# EAGLE schematic DC Electronic Load (EAGLE 9.4.0)
ERSTELLER: Jakob Holz; PROJEKT: DC Electronic Load; VERSION: V1.0

## Sheet 1 of 3
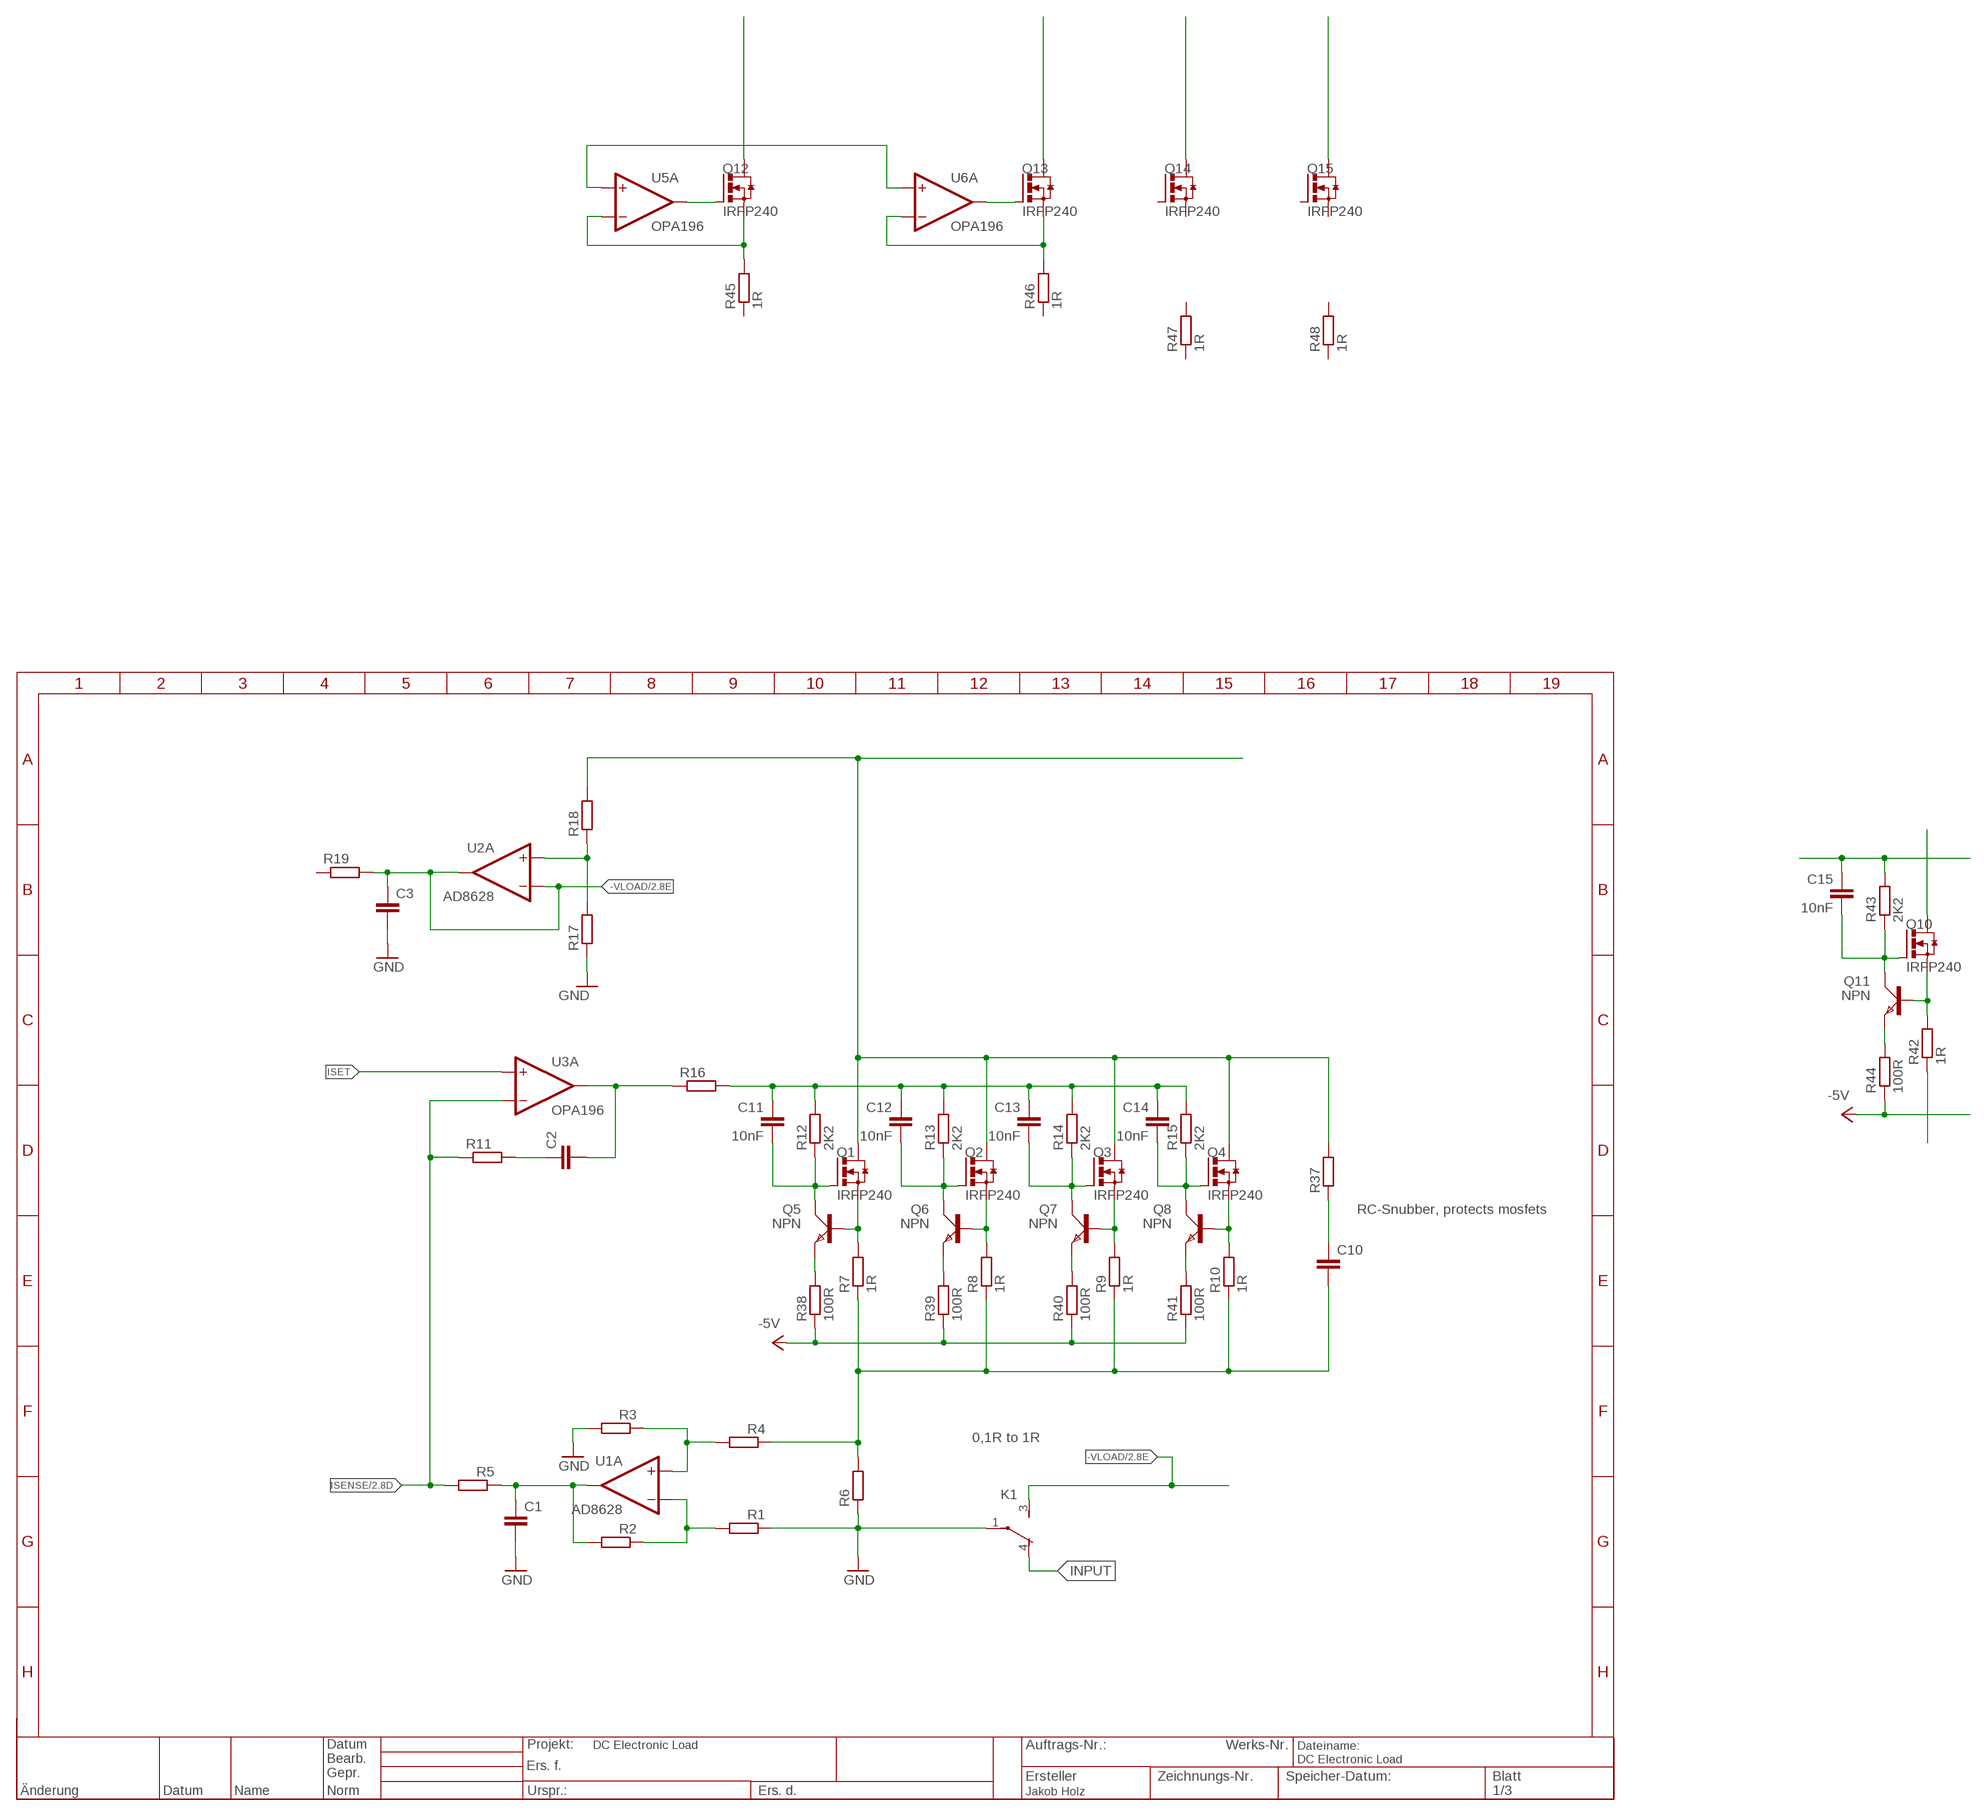
[diagram p0: schematic, sheet 1]
RAHMEN1 (RAHMEN_A4_8Z-19S): ERSTELLER: Jakob Holz; PROJEKT: DC Electronic Load

### Parts
C1  C-EUC1206  [C1206]
C2  C-EUC1206  [C1206]
C3  C-EUC1206  [C1206]
C10  C-EUC1206  [C1206]
C11  10nF  C-EUC1206  [C1206]
C12  10nF  C-EUC1206  [C1206]
C13  10nF  C-EUC1206  [C1206]
C14  10nF  C-EUC1206  [C1206]
C15  10nF  C-EUC1206  [C1206]
K1  AZ8-FORM-C  [AZ8]
Q1  IRFP240  [TO247BV]
Q2  IRFP240  [TO247BV]
Q3  IRFP240  [TO247BV]
Q4  IRFP240  [TO247BV]
Q5  NPN  [SOT23]
Q6  NPN  [SOT23]
Q7  NPN  [SOT23]
Q8  NPN  [SOT23]
Q10  IRFP240  [TO247BV]
Q11  NPN  [SOT23]
Q12  IRFP240  [TO247BV]
Q13  IRFP240  [TO247BV]
Q14  IRFP240  [TO247BV]
Q15  IRFP240  [TO247BV]
R1  R-EU_R1206  [R1206]
R2  R-EU_R1206  [R1206]
R3  R-EU_R1206  [R1206]
R4  R-EU_R1206  [R1206]
R5  R-EU_R1206  [R1206]
R6  R-EU_R1206  [R1206]
R7  1R  R-EU_VTA53  [VTA53]
R8  1R  R-EU_VTA53  [VTA53]
R9  1R  R-EU_VTA53  [VTA53]
R10  1R  R-EU_VTA53  [VTA53]
R11  R-EU_R1206  [R1206]
R12  2K2  R-EU_R1206  [R1206]
R13  2K2  R-EU_R1206  [R1206]
R14  2K2  R-EU_R1206  [R1206]
R15  2K2  R-EU_R1206  [R1206]
R16  R-EU_R1206  [R1206]
R17  R-EU_R1206  [R1206]
R18  R-EU_R1206  [R1206]
R19  R-EU_R1206  [R1206]
R37  R-EU_R1206  [R1206]
R38  100R  R-EU_R1206  [R1206]
R39  100R  R-EU_R1206  [R1206]
R40  100R  R-EU_R1206  [R1206]
R41  100R  R-EU_R1206  [R1206]
R42  1R  R-EU_VTA53  [VTA53]
R43  2K2  R-EU_R1206  [R1206]
R44  100R  R-EU_R1206  [R1206]
R45  1R  R-EU_VTA53  [VTA53]
R46  1R  R-EU_VTA53  [VTA53]
R47  1R  R-EU_VTA53  [VTA53]
R48  1R  R-EU_VTA53  [VTA53]
U1  AD8628  [SOIC-8]
U2  AD8628  [SOIC-8]
U3  OPA196  AD8628  [SOIC-8]
U5  OPA196  AD8628  [SOIC-8]
U6  OPA196  AD8628  [SOIC-8]

### Nets
+VLOAD: Q1.D Q2.D Q3.D Q4.D R18.2 R37.2 ; also sheet 2
+VLOAD1: Q10.D
-5V: R38.1 R39.1 R40.1 R41.1 R44.1
-VLOAD: C3.1 K1.3(-1:S) R19.2 U2.2(A:IN-) U2.6(A:OUT) ; also sheet 2
GND: C1.2 C3.2 K1.1(-1:P) R1.1 R3.2 R6.1 R17.1 ; also sheet 2,3
INPUT: K1.4(-1:O)
ISENSE: R5.2 R11.1 U3.2(A:IN-) ; also sheet 2
ISET: U3.3(A:IN+)
N$1: C1.1 R2.2 R5.1 U1.6(A:OUT)
N$2: R1.2 R2.1 U1.2(A:IN-)
N$3: R3.1 R4.2 U1.3(A:IN+)
N$4: C10.2 R4.1 R6.2 R7.1 R8.1 R9.1 R10.1
N$7: C2.1 R11.2
N$8: C2.2 R16.1 U3.6(A:OUT)
N$9: Q1.S Q5.1(B) R7.2
N$10: Q2.S Q6.1(B) R8.2
N$11: Q3.S Q7.1(B) R9.2
N$12: Q4.S Q8.1(B) R10.2
N$13: C11.1 C12.1 C13.1 C14.1 R12.2 R13.2 R14.2 R15.2 R16.2
N$14: C11.2 Q1.G Q5.3(C) R12.1
N$15: C12.2 Q2.G Q6.3(C) R13.1
N$16: C13.2 Q3.G Q7.3(C) R14.1
N$17: C14.2 Q4.G Q8.3(C) R15.1
N$19: Q6.2(E) R39.2
N$20: R17.2 R18.1 U2.3(A:IN+)
N$33: C10.1 R37.1
N$34: Q7.2(E) R40.2
N$35: Q8.2(E) R41.2
N$36: Q5.2(E) R38.2
N$37: R42.1
N$38: Q10.S Q11.1(B) R42.2
N$39: C15.1 R43.2
N$40: C15.2 Q10.G Q11.3(C) R43.1
N$41: Q11.2(E) R44.2
N$42: Q12.G U5.6(A:OUT)
N$43: Q12.D
N$44: Q12.S R45.2 U5.2(A:IN-)
N$45: Q13.D
N$46: Q14.D
N$47: Q15.D
N$48: Q13.S R46.2 U6.2(A:IN-)
N$49: Q13.G U6.6(A:OUT)
N$50: U5.3(A:IN+) U6.3(A:IN+)
Unconnected: Q14.G Q14.S Q15.G Q15.S R19.1 R45.1 R46.1 R47.1 R47.2 R48.1 R48.2 U5.4(B:V-) U5.7(B:V+) U6.4(B:V-) U6.7(B:V+)

### Notes on the sheet
- RC-Snubber, protects mosfets
- 0,1R to 1R

## Sheet 2 of 3
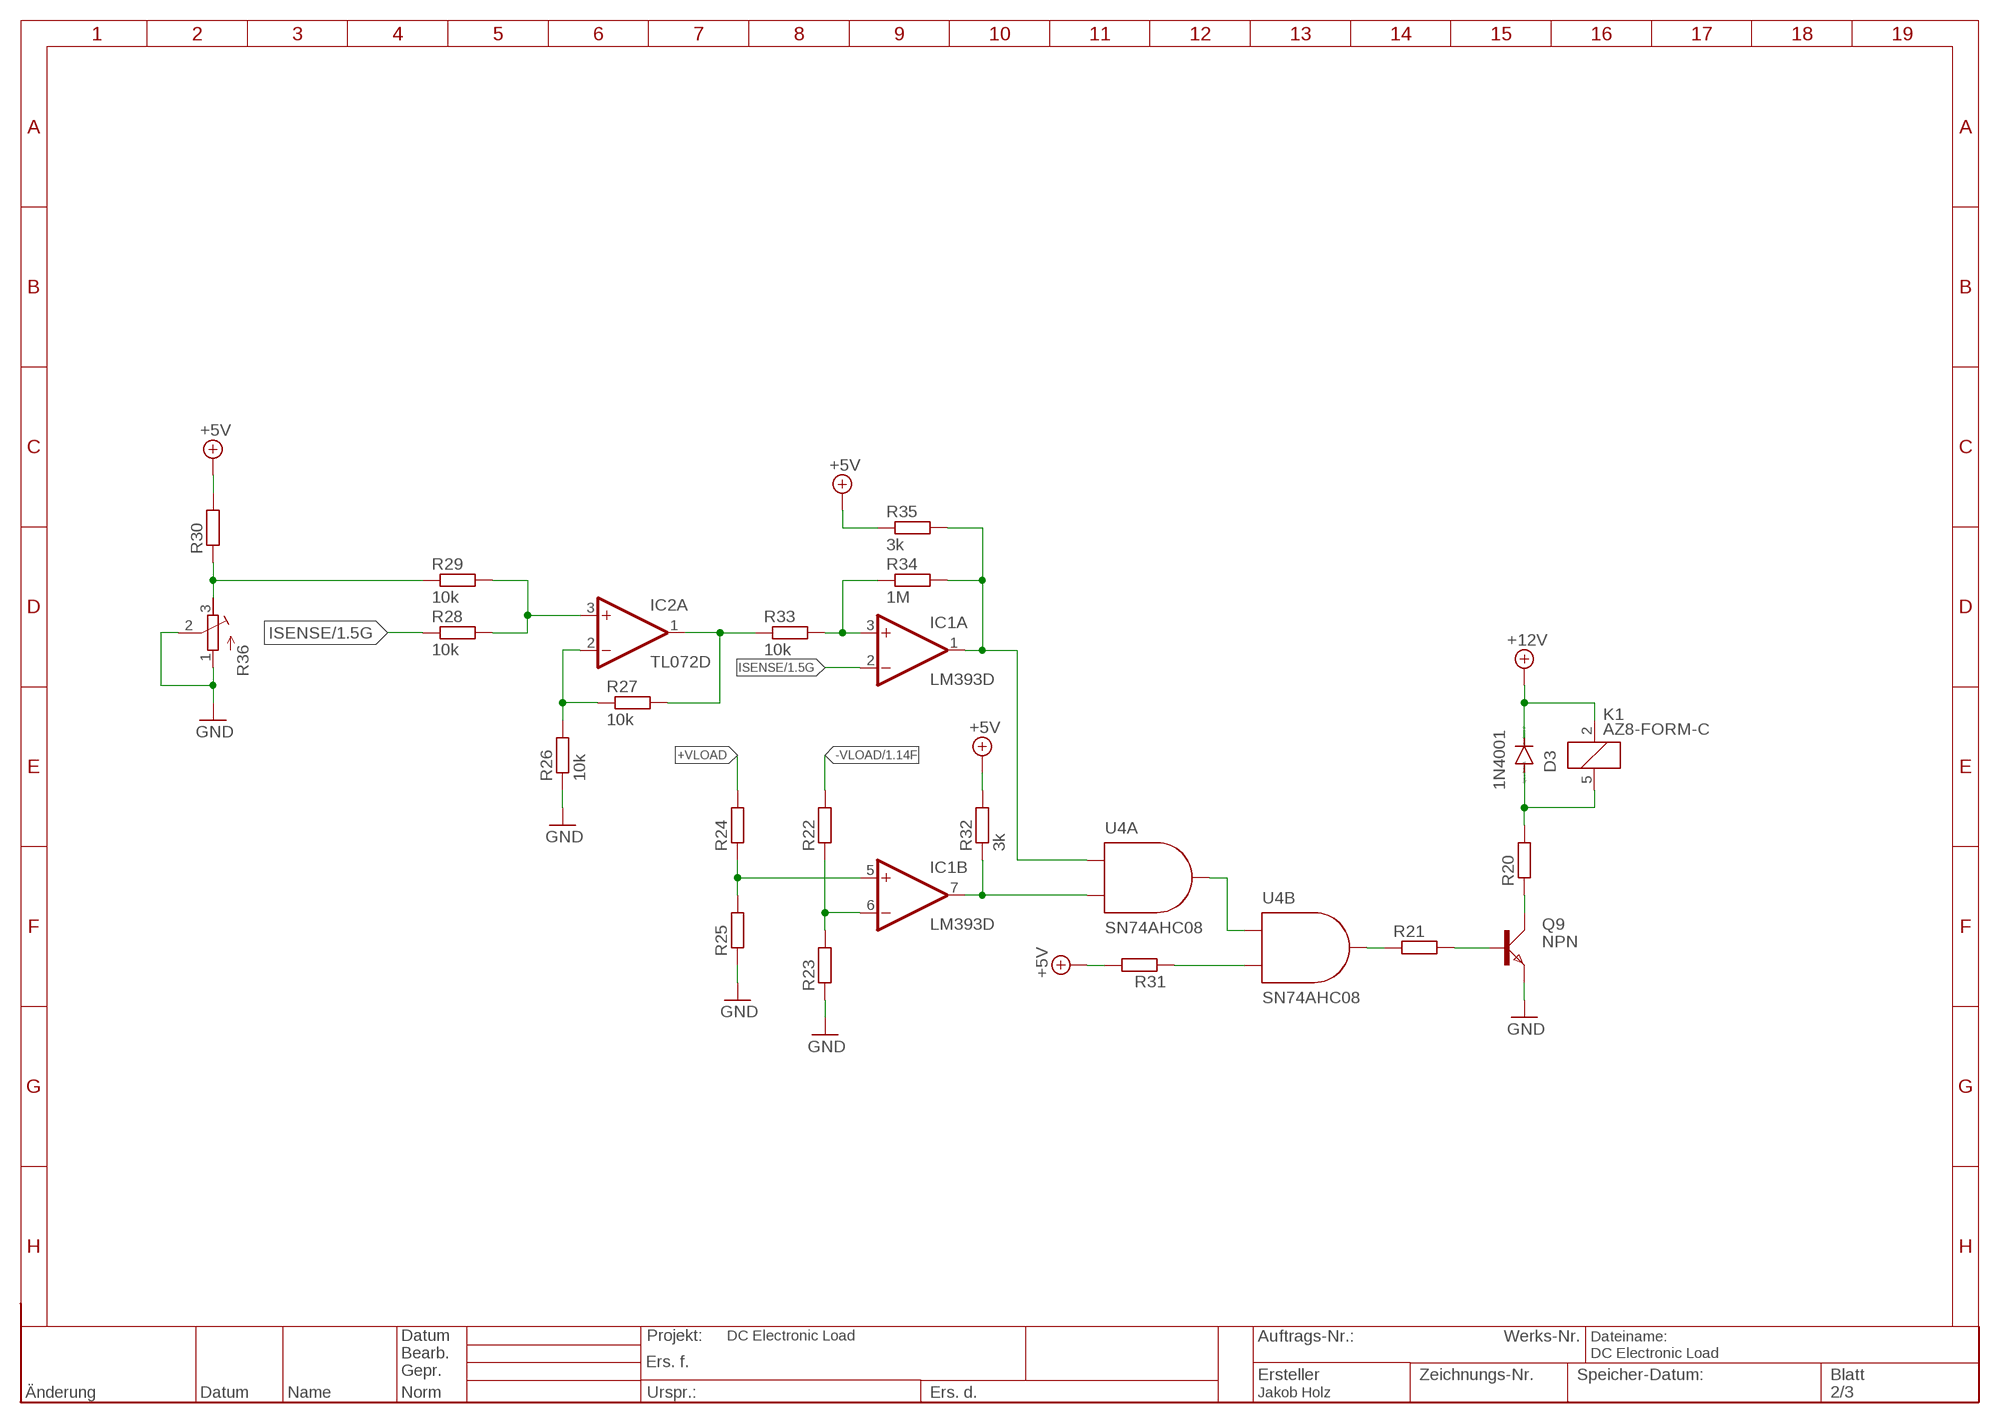
[diagram p1: schematic, sheet 2]

### Parts
D3  1N4001  DIODE-MELF-MLL41  [MELF-MLL41]
IC1  LM393D  [SO08]
IC2  TL072D  [SO08]
Q9  NPN  [SOT23]
R20  R-EU_R1206  [R1206]
R21  R-EU_R1206  [R1206]
R22  R-EU_R1206  [R1206]
R23  R-EU_R1206  [R1206]
R24  R-EU_R1206  [R1206]
R25  R-EU_R1206  [R1206]
R26  10k  R-EU_R1206  [R1206]
R27  10k  R-EU_R1206  [R1206]
R28  10k  R-EU_R1206  [R1206]
R29  10k  R-EU_R1206  [R1206]
R30  R-EU_R1206  [R1206]
R31  R-EU_R1206  [R1206]
R32  3k  R-EU_R1206  [R1206]
R33  10k  R-EU_R1206  [R1206]
R34  1M  R-EU_R1206  [R1206]
R35  3k  R-EU_R1206  [R1206]
R36  R-TRIMM64W  [RTRIM64W]
U4  SN74AHC08  [SOIC−14]

### Nets
+5V: R30.2 R31.2 R32.2 R35.1 ; also sheet 3
+12V: D3.C K1.2 ; also sheet 3
+VLOAD: R24.2 ; also sheet 1
-VLOAD: R22.2 ; also sheet 1
GND: Q9.2(E) R23.1 R25.1 R26.1 R36.1(A) R36.2(S) ; also sheet 1,3
ISENSE: IC1.2(A:-IN) R28.1 ; also sheet 1
N$5: IC1.6(B:-IN) R22.1 R23.2
N$6: IC1.5(B:+IN) R24.1 R25.2
N$18: IC1.7(B:OUT) R32.1 U4.2(A:B)
N$21: D3.A K1.5 R20.2
N$22: Q9.3(C) R20.1
N$23: U4.3(A:Y) U4.4(B:A)
N$24: Q9.1(B) R21.2
N$25: R31.1 U4.5(B:B)
N$26: IC1.1(A:OUT) R34.2 R35.2 U4.1(A:A)
N$27: IC2.3(A:+IN) R28.2 R29.2
N$28: IC2.2(A:-IN) R26.2 R27.1
N$29: IC2.1(A:OUT) R27.2 R33.1
N$30: IC1.3(A:+IN) R33.2 R34.1
N$31: R29.1 R30.1 R36.3(E)
N$32: R21.1 U4.6(B:Y)

## Sheet 3 of 3
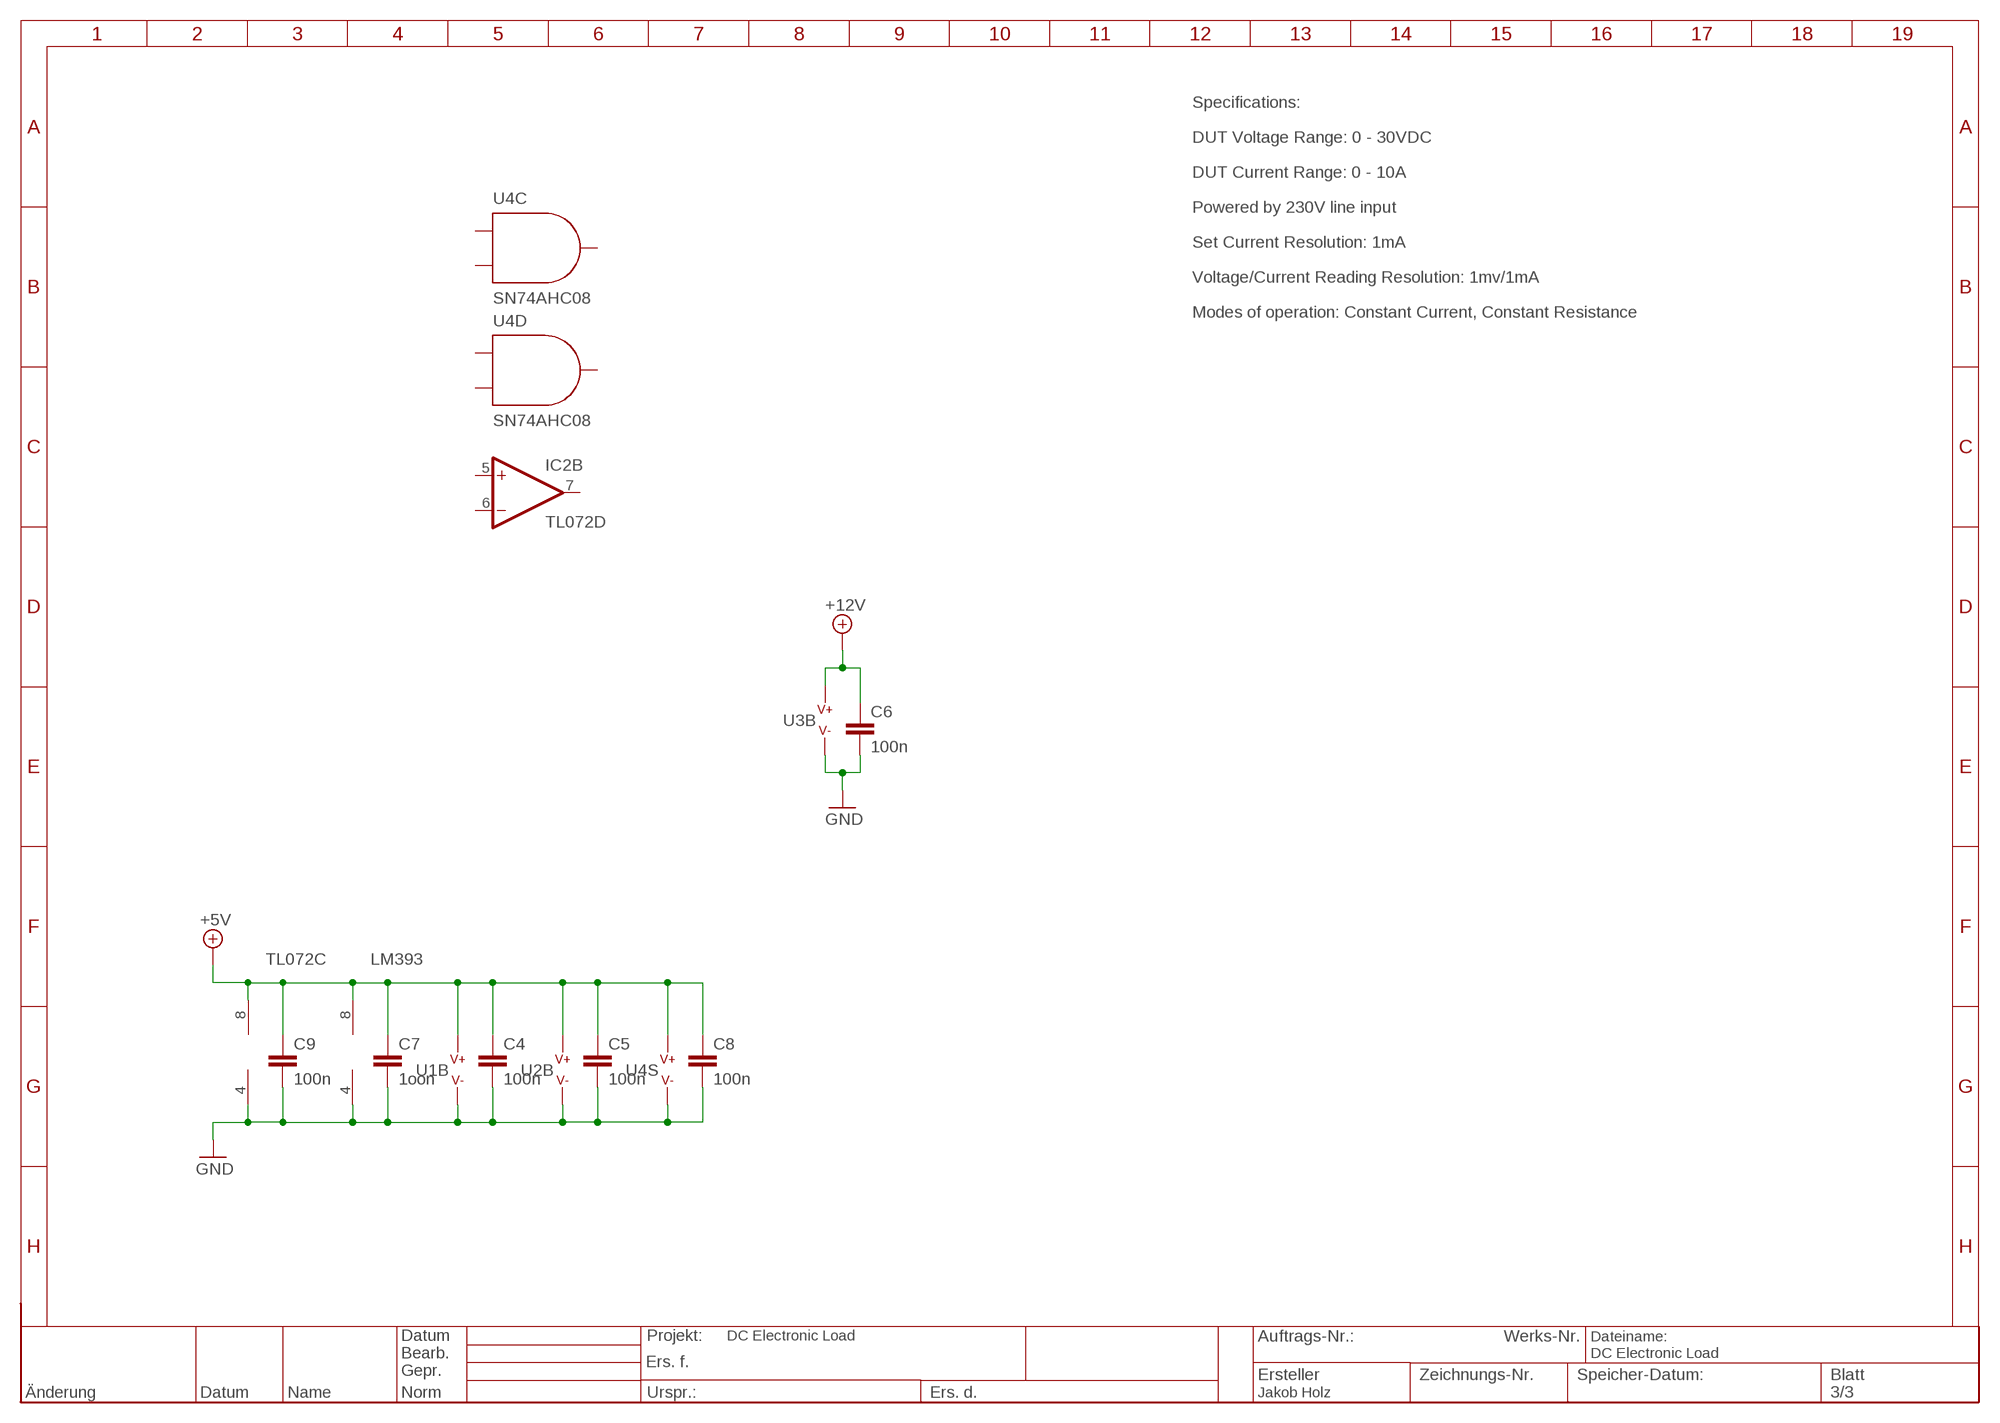
[diagram p2: schematic, sheet 3]

### Parts
C4  100n  C-EUC1206  [C1206]
C5  100n  C-EUC1206  [C1206]
C6  100n  C-EUC1206  [C1206]
C7  1oon  C-EUC1206  [C1206]
C8  100n  C-EUC1206  [C1206]
C9  100n  C-EUC1206  [C1206]

### Nets
+5V: C4.1 C5.1 C7.1 C8.1 C9.1 IC1.8(P:V+) IC2.8(P:V+) U1.7(B:V+) U2.7(B:V+) U4.14(S:V+) ; also sheet 2
+12V: C6.1 U3.7(B:V+) ; also sheet 2
GND: C4.2 C5.2 C6.2 C7.2 C8.2 C9.2 IC1.4(P:V-) IC2.4(P:V-) U1.4(B:V-) U2.4(B:V-) U3.4(B:V-) U4.7(S:V-) ; also sheet 1,2
Unconnected: IC2.5(B:+IN) IC2.6(B:-IN) IC2.7(B:OUT) U4.8(C:Y) U4.9(C:A) U4.10(C:B) U4.11(D:Y) U4.12(D:A) U4.13(D:B)

### Notes on the sheet
- Specifications:
- DUT Voltage Range: 0 - 30VDC
- DUT Current Range: 0 - 10A
- Powered by 230V line input
- Set Current Resolution: 1mA
- Voltage/Current Reading Resolution: 1mv/1mA
- Modes of operation: Constant Current, Constant Resistance
- TL072C | LM393

## Library data of the parts
C1-C15 = rcl:C-EU: CAPACITOR, European symbol; SPICEPREFIX: C
D3 = diode:DIODE-: DIODE
IC1 = linear:LM393: COMPARATOR
IC2 = linear:TL072: OP AMP
K1 = relay:AZ8-FORM-C: MINIATURE PC BOARD RELAY Form C Source: www.azettler.com .. AZ8-1ch-12DSE.PDF; OC_FARNELL: unknown; OC_NEWARK: unknown
Q1-Q4 Q10 Q12-Q15 = transistor-power:IRFP240: HEXFET Power MosFet Source: http://www.irf.com/
Q5-Q9 Q11 = Jakobs_LBR:NPN
R1-R6 R11-R35 R37-R41 R43 R44 = rcl:R-EU_: RESISTOR, European symbol; SPICEPREFIX: R
R7-R10 R42 R45-R48 = resistor:R-EU_: RESISTOR, European symbol
R36 = resistor:R-TRIMM: Trimm resistor
U1-U3 U5 U6 = Jakobs_LBR:AD8628
U4 = Jakobs_LBR:SN74AHC08